# EAGLE design oximeter (EAGLE 9.6.2)
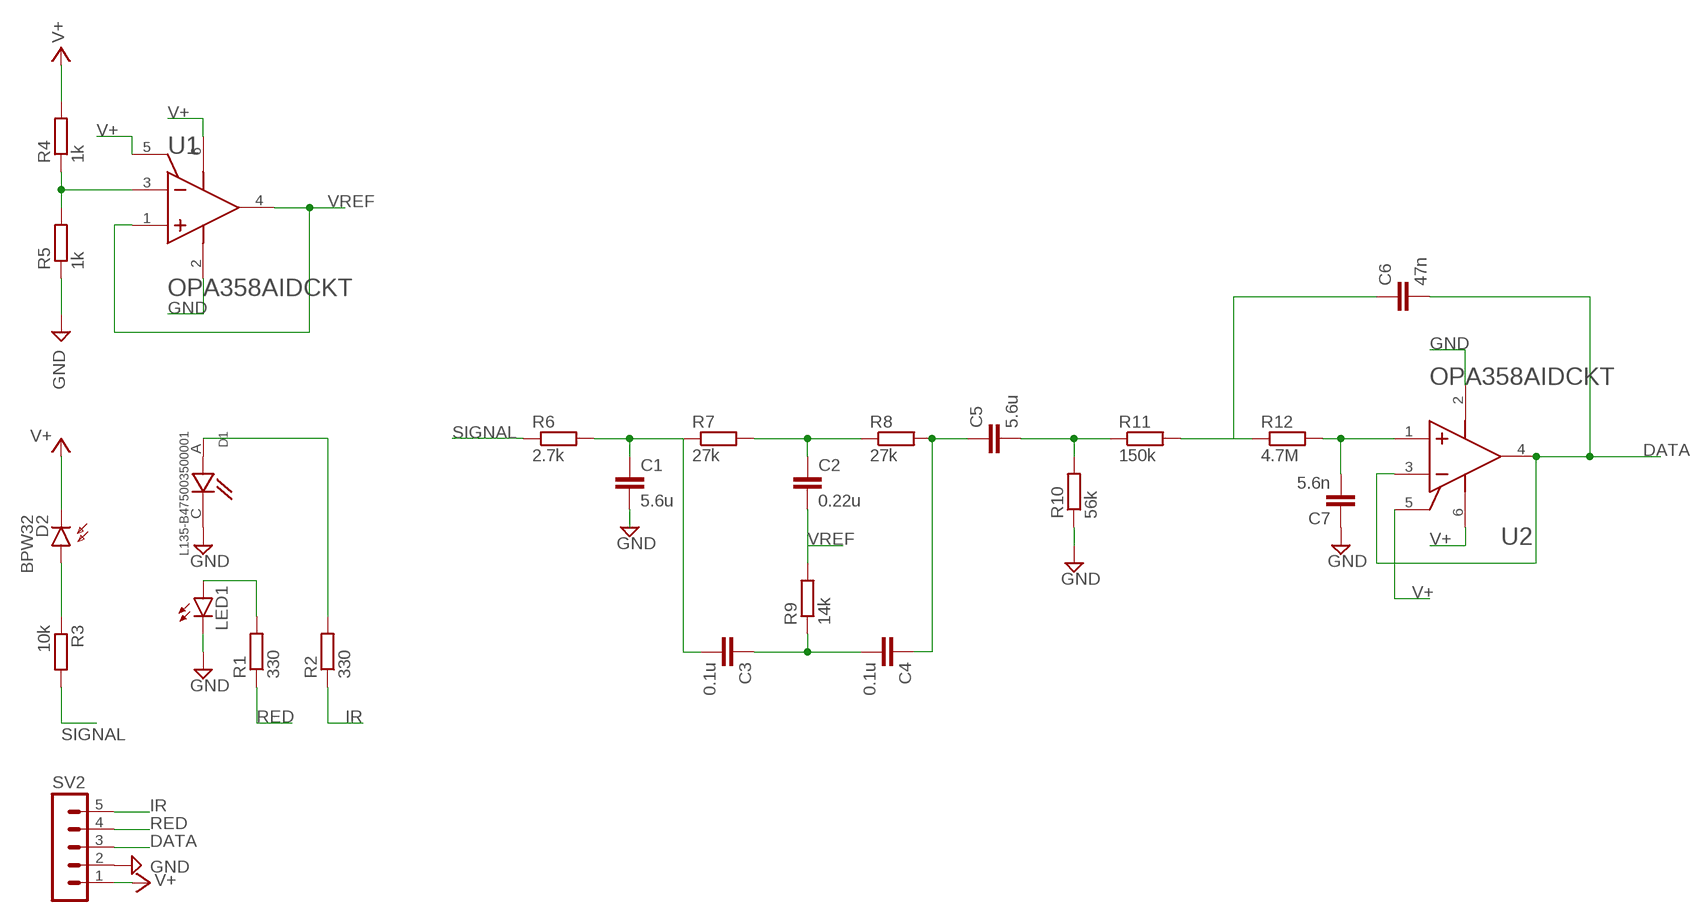
[diagram p0: schematic, sheet 1]

## Parts
C1  5.6u  C-EUC0603  [C0603]
C2  0.22u  C-EUC0603  [C0603]
C3  0.1u  C-EUC0603  [C0603]
C4  0.1u  C-EUC0603  [C0603]
C5  5.6u  C-EUC0603  [C0603]
C6  47n  C-EUC0603  [C0603]
C7  5.6n  C-EUC0603  [C0603]
D1  L135-B475003500001  [LED_L135-B475003500001]
D2  BPW32  [BPW32]
LED1  LEDCHIP-LED0603  [CHIP-LED0603]
R1  330  R-EU_R0603  [R0603]
R2  330  R-EU_R0603  [R0603]
R3  10k  R-EU_R0603  [R0603]
R4  1k  R-EU_R0603  [R0603]
R5  1k  R-EU_R0603  [R0603]
R6  2.7k  R-EU_R0603  [R0603]
R7  27k  R-EU_R0603  [R0603]
R8  27k  R-EU_R0603  [R0603]
R9  14k  R-EU_R0603  [R0603]
R10  56k  R-EU_R0603  [R0603]
R11  150k  R-EU_R0603  [R0603]
R12  4.7M  R-EU_R0603  [R0603]
SV2  MA05-1  [MA05-1]
U1  TEXAS_INSTRUMENTS_OPA358AIDCKTTEXAS_INSTRUMENTS_OPA358AIDCKT_0_0  [TEXAS_INSTRUMENTS_OPA358AIDCKT_0]
U2  TEXAS_INSTRUMENTS_OPA358AIDCKTTEXAS_INSTRUMENTS_OPA358AIDCKT_0_0  [TEXAS_INSTRUMENTS_OPA358AIDCKT_0]

## Nets
DATA: C6.2 SV2.3 U2.3(IN-) U2.4(OUT)
GND: C1.2 C7.1 D1.C LED1.C R5.1 R10.1 SV2.2 U1.2(GND) U2.2(GND)
IR: R2.1 SV2.5
N$1: D2.A R3.1
N$2: D1.A R2.2
N$3: LED1.A R1.2
N$4: R4.1 R5.2 U1.3(IN-)
N$5: C1.1 C3.2 R6.2 R7.1
N$6: C2.1 R7.2 R8.1
N$7: C7.2 R12.2 U2.1(IN+)
N$8: C3.1 C4.2 R9.1
N$10: C4.1 C5.1 R8.2
N$11: C5.2 R10.2 R11.1
N$13: C6.1 R11.2 R12.1
RED: R1.1 SV2.4
SIGNAL: R3.2 R6.1
V+: D2.K(C) R4.2 SV2.1 U1.5(ENABLE) U1.6(V+) U2.5(ENABLE) U2.6(V+)
VREF: C2.2 R9.2 U1.1(IN+) U1.4(OUT)

## Library data of the parts
C1-C7 = rcl:C-EU: CAPACITOR, European symbol; SPICEPREFIX: C
D1 = L135-B475003500001:L135-B475003500001: Check prices <https://pricing.snapeda.com/parts/L135-B475003500001/Lumileds/view-part?ref=eda>; AVAILABILITY: Not in stock; DESCRIPTION: LED Lighting Color LUXEON 3535L Blue 475nm (469nm ~ 480nm) 1414 (3535 Metric); MF: Lumileds; MP: L135-B475003500001; PACKAGE: 1414 Philips Lumileds; PRICE: None
D2 = opto-trans-siemens:BPW32: PHOTO DIODE; OC_FARNELL: unknown; OC_NEWARK: unknown
LED1 = led:LED: LED OSRAM: - CHIPLED LG R971, LG N971, LY N971, LG Q971, LY Q971, LO R971, LY R971 LH N974, LH R974 LS Q976, LO Q976, LY Q976 LO Q996 - Hyper CHIPLED LW Q18S LB Q993, LB Q99A, LB R99A - SideLED LS A670, LO A670, LY A670, LG A670, LP A670 LB A673, LV A673, LT A673, LW A673 LH A674 LY A675 LS A676, LA A676, LO A676, LY A676, LW A676 LS A679, LY A679, LG A679 - Hyper Micro SIDELED® LS Y876, LA Y876, LO Y876, LY Y876 LT Y87S - SmartLED LW L88C, LW L88S LB L89C, LB L89S, LG L890 LS L89K, LO L89K, LY L89K LS L896, LA L896, LO L896, LY L896 - TOPLED LS T670, LO T670, LY T670, LG T670, LP T670 LSG T670, LSP T670, LSY T670, LOP T670, LYG T670 LG T671, LOG T671, LSG T671 LB T673, LV T673, LT T673, LW T673 LH T674 LS T676, LA T676, LO T676, LY T676, LB T676, LH T676, LSB T676, LW T676 LB T67C, LV T67C, LT T67C, LS T67K, LO T67K, LY T67K, LW E67C LS E67B, LA E67B, LO E67B, LY E67B, LB E67C, LV E67C, LT E67C LW T67C LS T679, LY T679, LG T679 LS T770, LO T770, LY T770, LG T770, LP T770 LB T773, LV T773, LT T773, LW T773 LH T774 LS E675, LA E675, LY E675, LS T675 LS T776, LA T776, LO T776, LY T776, LB T776 LHGB T686 LT T68C, LB T68C - Hyper Mini TOPLED® LB M676 - Mini TOPLED Santana® LG M470 LS M47K, LO M47K, LY M47K Source: http://www.osram.convergy.de LUXEON: - LUMILED® LXK2-PW12-R00, LXK2-PW12-S00, LXK2-PW14-U00, LXK2-PW14-V00 LXK2-PM12-R00, LXK2-PM12-S00, LXK2-PM14-U00 LXK2-PE12-Q00, LXK2-PE12-R00, LXK2-PE12-S00, LXK2-PE14-T00, LXK2-PE14-U00 LXK2-PB12-K00, LXK2-PB12-L00, LXK2-PB12-M00, LXK2-PB14-N00, LXK2-PB14-P00, LXK2-PB14-Q00 LXK2-PR12-L00, LXK2-PR12-M00, LXK2-PR14-Q00, LXK2-PR14-R00 LXK2-PD12-Q00, LXK2-PD12-R00, LXK2-PD12-S00 LXK2-PH12-R00, LXK2-PH12-S00 LXK2-PL12-P00, LXK2-PL12-Q00, LXK2-PL12-R00 Source: www.luxeon.com KINGBRIGHT: KA-3528ASYC Source: www.kingbright.com
R1-R12 = rcl:R-EU_: RESISTOR, European symbol; SPICEPREFIX: R
SV2 = con-lstb:MA05-1: PIN HEADER; OC_FARNELL: unknown; OC_NEWARK: unknown
U1 U2 = Texas Instruments - OPA358AIDCKT:TEXAS_INSTRUMENTS_OPA358AIDCKT: TI-OPA358DCK6; ACL_MIN_STABLE_GAINVV: 1; BW__ACLMHZ: 75; CIIVA_IDS: 1324051; CODE__JEDEC: MO-203; COMPONENT_LINK_1_DESCRIPTION: Manufacturer URL; COMPONENT_LINK_1_URL: http://www.ti.com/; COMPONENT_LINK_3_DESCRIPTION: Package Specification; COMPONENT_LINK_3_URL: http://www.ti.com/litv/pdf/mpds114c; DATASHEET: http://www.ti.com/general/docs/lit/getliterature.tsp?genericPartNumber=OPA358&fileType=pdf; DATASHEET_VERSION: SB0S296C; DIFF_GAIN: 0.3; DIFF_PHASEDEG: 0.7; FOOTPRINT_VARIANT_NAME_0: Level C; FOOTPRINT_VARIANT_NAME_1: Level B; FOOTPRINT_VARIANT_NAME_2: Level A; IIB_MAXN_A: 0.05; IMPORTED: yes; IMPORTED_FROM: vault; IMPORT_TS: 1521843382; IO_TYPM_A: 80; IQ_PER_CHANNELMAXMA: 6.5; MF: Texas Instruments; MOUNTING_TECHNOLOGY: Surface Mount; MPN: OPA358AIDCKT; NUMBER_OF_CHANNELS: 1; PACKAGE: DCK0006A; PACKAGE_DESCRIPTION: 6-Pin Plastic Small Outline, Body 2 x 1.25 mm, Pitch 0.65 mm; PACKAGE_VERSION: 4093553-4/G, 01/2007; PREFIX: U; RAIL__RAIL: Out; RELEASE_DATE: 1464179843; ROHS: Yes; SLEW_RATETYPVUS: 55; SUB_FAMILY: High Output Current Amplifier (>=50mA), High Speed Amplifier (>=50MHz), Low Supply Voltage Amplifier (<=2.7V); VAULT_GUID: 9F741563-1AAA-47A0-8093-11027E473F15; VAULT_REVISION: BC2C785B-A002-4582-8152-7C0367823337; VIO_MAXM_V: 6; VN_AT_FLATBANDTYPNVRTHZ: 6.4; VS_MAX_V: 3.3; VS_MIN_V: 2.7

## Board
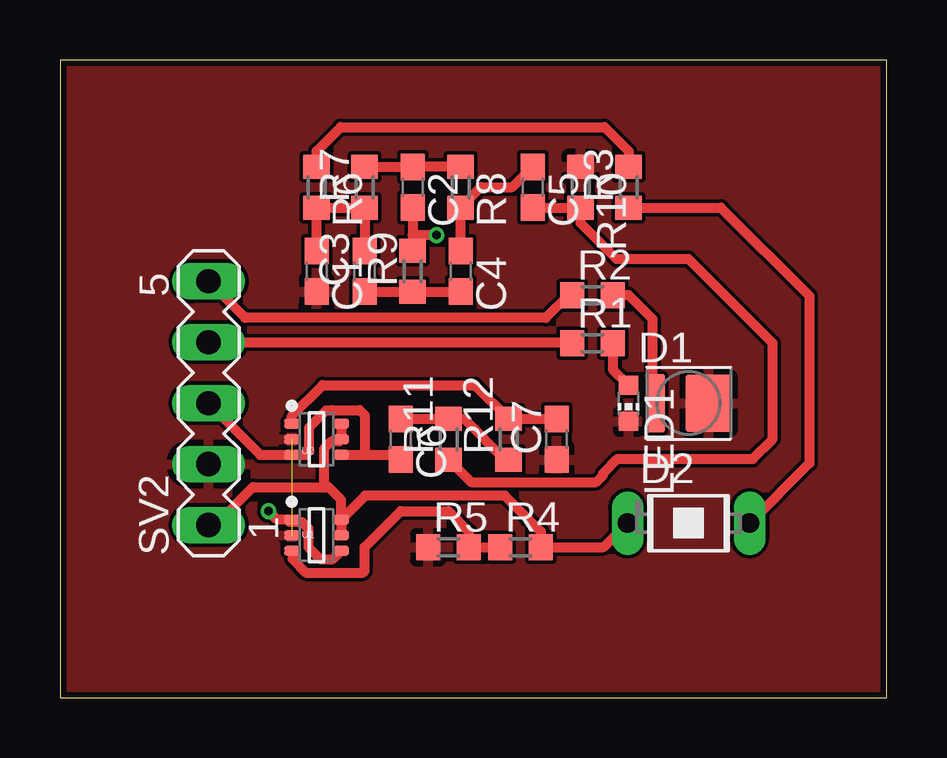
[diagram p1: board, top side]
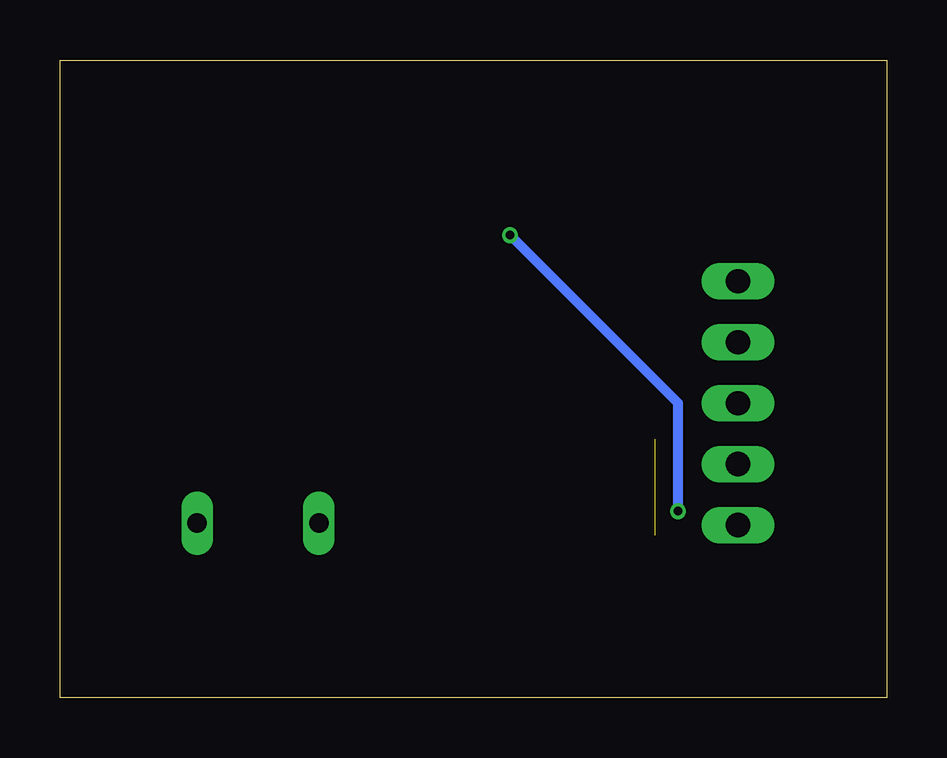
[diagram p2: board, bottom side, seen from below]

Size 34.44 x 26.57 mm. Coordinates in mm from the lower left corner, seen from the top.
Outline: 0,0 34.44,0 34.44,26.57 0,26.57 0,0
Copper layers (1*16): Top 0.035mm / dielectric 1.5mm / Bottom 0.035mm
Design rules "SeeedStudio_2layer_DRU_no_angle_20140221": minimum track width 6mil, minimum drill 12mil, track to track 6mil, track to pad 6mil, pad to pad 6mil, via to via 6mil, smd to smd 0mil, copper to edge 10mil, drill to drill 10mil, minimum pad ring 10mil, minimum via ring 6mil, stop-mask expansion 2mil, vias tented up to drill 100mil, thermal gap 10mil

### Footprints (pad centres in the part's own frame; a part is rotated, then mirrored left to right if it is on the bottom)
C0603 = smd 1.1 x 1: 1 -0.85,0; 2 0.85,0
LED_L135-B475003500001 = smd 0.82 x 2.4: A -1.39,0 | smd 1.93 x 2.4: C 0.835,0
BPW32 = drill 0.813 long: A 0,2.54; K 0,-2.54
CHIP-LED0603 = smd 0.8 x 0.8: A 0,-0.75; C 0,0.75
R0603 = smd 1 x 1.1: 1 -0.85,0; 2 0.85,0
MA05-1 = drill 1.016 long: 1 -5.08,0; 2 -2.54,0; 3 0,0; 4 2.54,0; 5 5.08,0
TEXAS_INSTRUMENTS_OPA358AIDCKT_0 = smd 0.65 x 0.4: 1 -1.025,0.65; 2 -1.025,0; 3 -1.025,-0.65; 4 1.025,-0.65; 5 1.025,0; 6 1.025,0.65

### Placement (x,y rotation side)
C1  10.69,17.77 270 top
C2  14.69,21.27 270 top
C3  12.69,17.77 90 top
C4  16.69,17.77 270 top
C5  19.69,21.27 270 top
C6  14.19,10.77 270 top
C7  20.69,10.77 90 top
D1  26.19,12.27 0 top
D2  26.19,7.27 270 top
LED1  23.69,12.27 180 top
R1  22.19,14.77 0 top
R2  22.19,16.77 0 top
R3  23.69,21.27 90 top
R4  19.19,6.27 0 top
R5  16.19,6.27 0 top
R6  10.69,21.27 270 top
R7  12.69,21.27 90 top
R8  16.69,21.27 270 top
R9  14.69,17.77 90 top
R10  21.69,21.27 270 top
R11  16.19,10.77 90 top
R12  18.69,10.77 90 top
SV2  6.19,12.27 90 top
U1  10.69,6.77 0 top
U2  10.69,10.77 0 top

### Tracks (layer width: path | path; a pad name or v marks a point on that pad's centre or on a via)
DATA
  Top 0.406: U2.4 12.69,10.12 | 12.69,10.12 13.99,10.12 C6.2 | 12.69,10.12 12.69,11.77 12.48,11.98 11.3,11.98 11.29,11.97 11.09,11.97 10.39,11.27 10.39,10.27 10.24,10.12 U2.3 8.34,10.12 SV2.3
GND  (1 unrouted)
  pour Top: 0.09,26.77 34.69,26.77 34.69,0.11 0.09,0.11
IR
  Top 0.406: R2.1 21.19,16.77 20.25,15.83 7.71,15.83 SV2.5
N$1
  Top 0.406: D2.A 31.22,9.76 31.22,16.74 27.54,20.42 R3.1
N$2
  Top 0.406: R2.2 23.19,16.77 23.69,16.77 24.69,15.77 24.69,12.38 D1.A
N$3
  Top 0.406: R1.2 23.04,13.67 LED1.A
N$4
  Top 0.406: R4.1 R5.2 17.04,6.92 16.19,7.77 14.19,7.77 12.69,6.27 12.69,5.27 12.63,5.21 10.25,5.21 9.69,5.77 9.69,6.1 U1.3
N$5
  Top 0.406: C1.1 R6.2 R7.1 C3.2
N$6
  Top 0.406: R8.1 C2.1 R7.2
N$7
  Top 0.406: C7.2 R12.2 17.28,13.03 10.95,13.03 9.67,11.75 U2.1
N$8
  Top 0.406: C4.2 R9.1 C3.1
N$10
  Top 0.406: C5.1 18.84,21.27 17.54,21.27 R8.2 C4.1
N$11
  Top 0.406: C5.2 R10.2 21.69,19.77 23.19,18.27 26.19,18.27 29.69,14.77 29.69,10.77 28.87,9.95 23.23,9.95 22.63,9.35 22.63,9.27 22.34,8.98 17.13,8.98 R11.1
N$13
  Top 0.406: C6.1 R11.2 16.84,11.62 18.54,9.92 R12.1
RED
  Top 0.406: SV2.4 21.3,14.81 R1.1
SIGNAL
  Top 0.406: R3.2 23.69,22.77 22.69,23.77 11.69,23.77 10.69,22.77 R6.1
V+
  Top 0.406: D2.K 22.65,6.27 R4.2 20.04,6.92 18.54,8.42 12.71,8.42 U1.6 | U1.6 11.71,8.25 11.19,8.77 10.89,8.77 | 10.89,8.77 8.04,8.77 6.46,7.19 SV2.1 | U1.6 U1.5 | U2.6 U2.5 11.62,10.68 11.3,10.68 10.99,10.36 10.99,8.87 10.89,8.77
VREF  (via drill 0.35)
  Top 0.406: U1.1 9.57,7.33 | C2.2 14.69,19.27 | 14.69,19.27 R9.2 | U1.1 9.76,7.33 10.08,7.33 10.35,7.06 10.35,6.27 10.85,5.77 11.36,5.77 U1.4 | U1.1 9.04,7.42 v8.69,7.77 | v15.69,19.27 14.69,19.27
  Bottom 0.406: v8.69,7.77 8.69,12.27 v15.69,19.27